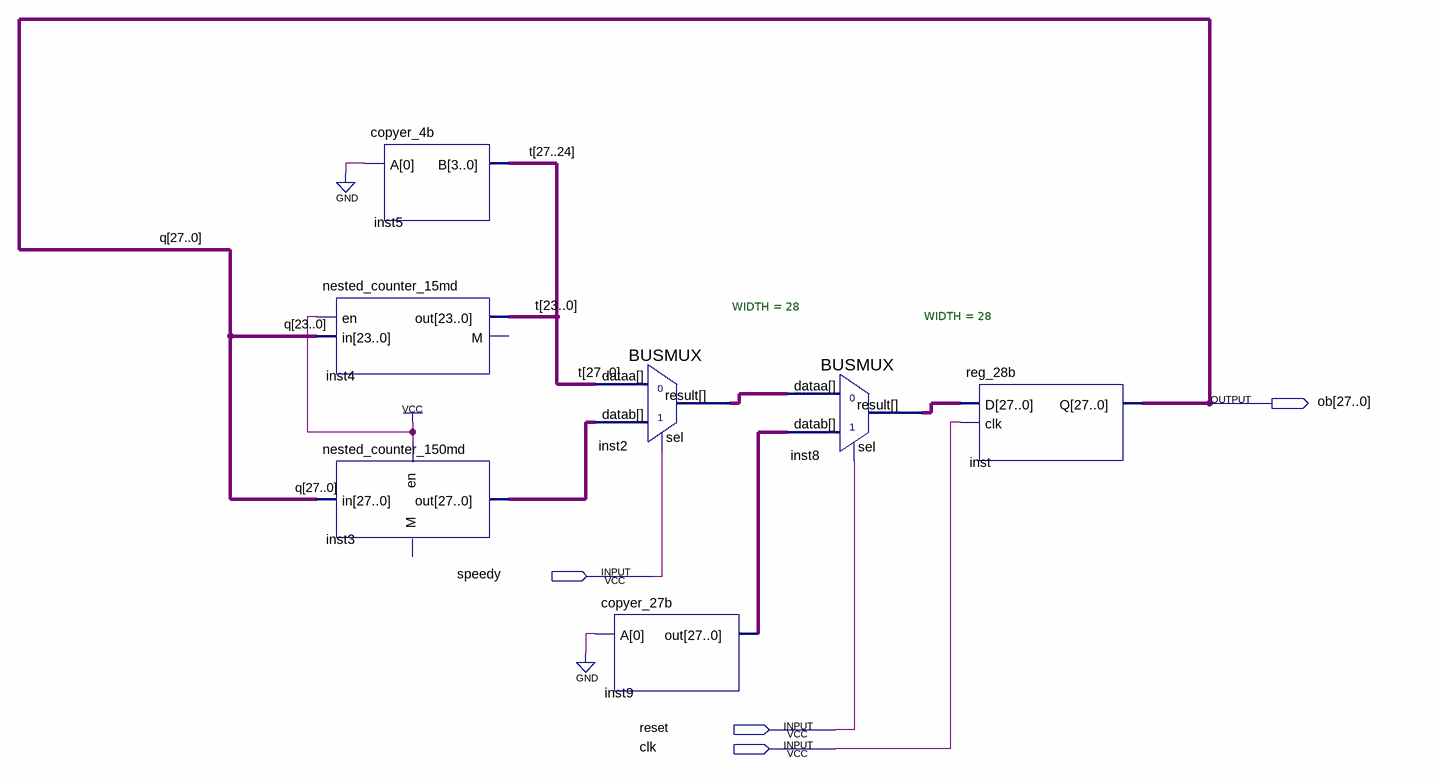
[diagram p0: schematic sheet]
// Quartus schematic one2tenHz.bdf as structural Verilog: 7 symbols, 4 pins
module one2tenHz (
  input  speedy,
  input  reset,
  input  clk,
  output [27:0] ob
);

  wire [27:0] inst2_result, inst3_out, inst8_result, inst9_out, t;

  copyer_4b inst5 (.A(1'b0), .B(t[27:24]));
  nested_counter_15md inst4 (.en(1'b1), .in(ob[23:0]), .out(t[23:0]));  // open: M
  nested_counter_150md inst3 (.en(1'b1), .in(ob), .out(inst3_out));  // open: M
  BUSMUX #(.WIDTH(28)) inst2 (.datab(inst3_out), .sel(speedy), .dataa(t), .result(inst2_result));
  copyer_27b inst9 (.A(1'b0), .out(inst9_out));
  BUSMUX #(.WIDTH(28)) inst8 (.datab(inst9_out), .sel(reset), .dataa(inst2_result), .result(inst8_result));
  reg_28b inst (.D(inst8_result), .clk(clk), .Q(ob));

  // Other names for the same wires on the sheet: q[27:0] = ob
endmodule
